# Altium schematic sheet SHT_1_Top Level_07349-R5_L10.SchDoc
size B; CompanyName: Microchip Technology Inc.; Organization: Microchip Technology; Address1: 2355 West Chandler Blvd.; Address2: Chandler, AZ  85224; Address4: USA; SheetNumber: 1; SheetTotal: 9; SheetTitle: Top Level Block Diagram; Time: Time
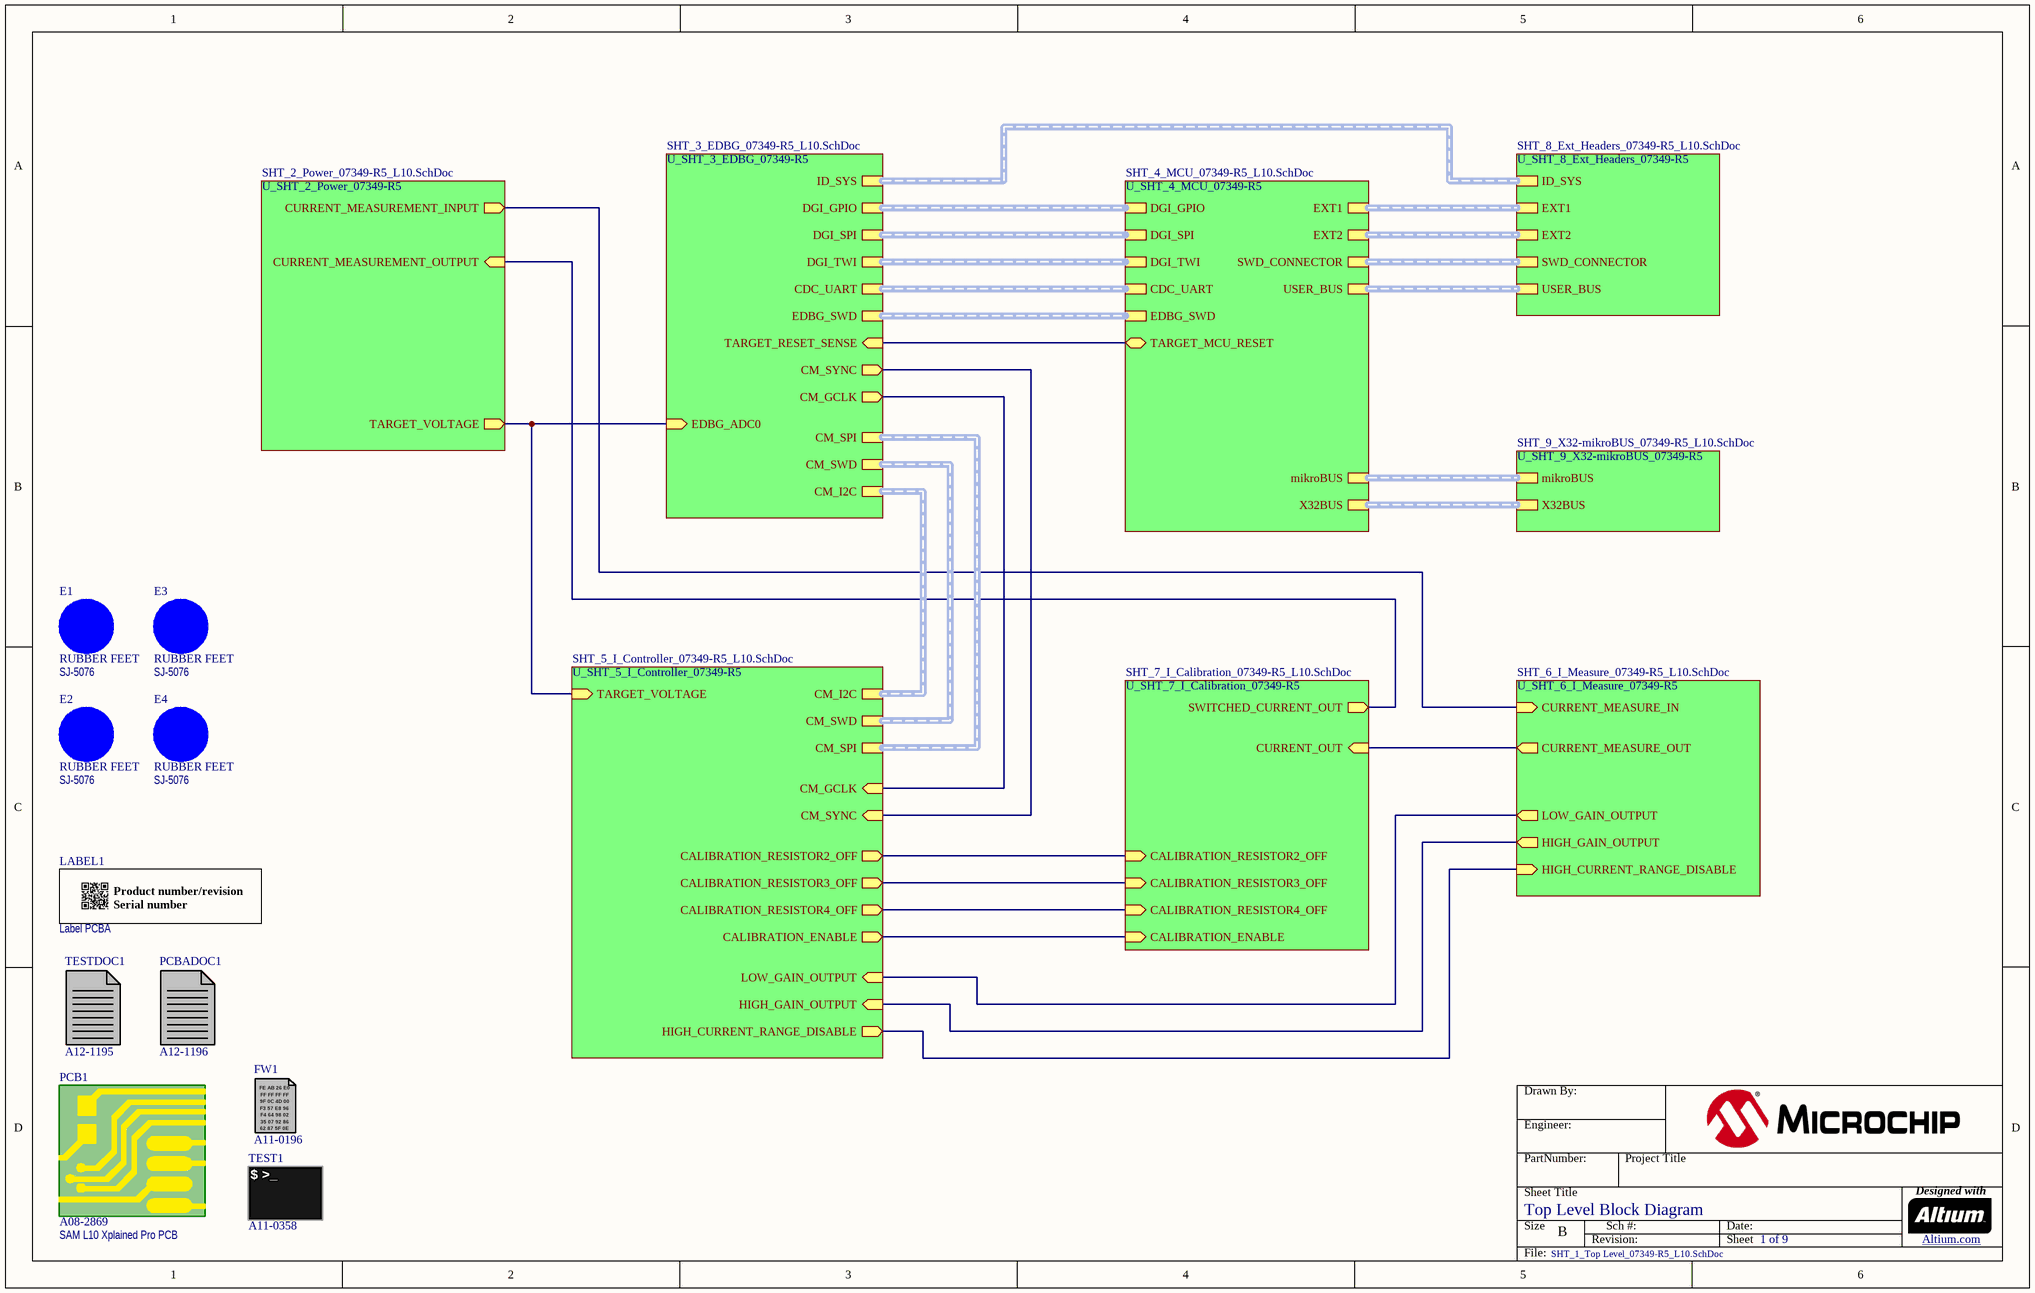
[diagram p0: SHT_1_Top Level_07349-R5_L10.SchDoc]

## Parts
?  (no value)  (graphical)
E1  RUBBER FEET  value SJ-5076  [AP8-00192]
E2  RUBBER FEET  value SJ-5076  [AP8-00192]
E3  RUBBER FEET  value SJ-5076  [AP8-00192]
E4  RUBBER FEET  value SJ-5076  [AP8-00192]
FW1  AN: A11-0196  (hidden comment: FW)  (mechanical)
LABEL1  value Label PCBA  [AP8-00317]  (hidden comment: PCBA_LABEL)
PCB1  value SAM L10 Xplained Pro PCB  AN: A08-2869  (hidden comment: PCB)  (mechanical)
PCBADOC1  AN: A12-1196  (hidden comment: PCBADOC)  (mechanical)
TEST1  AN: A11-0358  (hidden comment: TEST)  (mechanical)
TESTDOC1  AN: A12-1195  (hidden comment: TESTDOC)  (mechanical)

## Sub-sheets
U_SHT_2_Power_07349-R5 = SHT_2_Power_07349-R5_L10.SchDoc: TARGET_VOLTAGE (out), CURRENT_MEASUREMENT_INPUT (out), CURRENT_MEASUREMENT_OUTPUT (in)
U_SHT_3_EDBG_07349-R5 = SHT_3_EDBG_07349-R5_L10.SchDoc: CDC_UART (harness CDC_UART), DGI_TWI (harness DGI_TWI), DGI_SPI (harness DGI_SPI), DGI_GPIO (harness DGI_GPIO), ID_SYS (harness ID_SYS), EDBG_ADC0 (in), CM_I2C (harness CM_I2C), CM_GCLK (out), CM_SYNC (out), CM_SWD (harness CM_SWD), CM_SPI (harness CM_SPI), EDBG_SWD (harness EDBG_SWD), TARGET_RESET_SENSE (in)
U_SHT_4_MCU_07349-R5 = SHT_4_MCU_07349-R5_L10.SchDoc: DGI_GPIO (harness DGI_GPIO), DGI_SPI (harness DGI_SPI), DGI_TWI (harness DGI_TWI), CDC_UART (harness CDC_UART), EXT2 (harness EXT), EXT1 (harness EXT), SWD_CONNECTOR (harness SWD), TARGET_MCU_RESET (bidir), EDBG_SWD (harness EDBG_SWD), mikroBUS (harness mikroBUS), X32BUS (harness X32BUS), USER_BUS (harness USER_BUS)
U_SHT_5_I_Controller_07349-R5 = SHT_5_I_Controller_07349-R5_L10.SchDoc: LOW_GAIN_OUTPUT (in), HIGH_GAIN_OUTPUT (in), HIGH_CURRENT_RANGE_DISABLE (out), CM_SPI (harness CM_SPI), CALIBRATION_RESISTOR4_OFF (out), CALIBRATION_RESISTOR2_OFF (out), CALIBRATION_RESISTOR3_OFF (out), CALIBRATION_ENABLE (out), CM_I2C (harness CM_I2C), CM_GCLK (in), CM_SYNC (in), TARGET_VOLTAGE (in), CM_SWD (harness CM_SWD)
U_SHT_6_I_Measure_07349-R5 = SHT_6_I_Measure_07349-R5_L10.SchDoc: LOW_GAIN_OUTPUT (out), HIGH_GAIN_OUTPUT (out), HIGH_CURRENT_RANGE_DISABLE (in), CURRENT_MEASURE_OUT (out), CURRENT_MEASURE_IN (in)
U_SHT_7_I_Calibration_07349-R5 = SHT_7_I_Calibration_07349-R5_L10.SchDoc: CALIBRATION_RESISTOR3_OFF (in), CALIBRATION_RESISTOR4_OFF (in), CALIBRATION_RESISTOR2_OFF (in), SWITCHED_CURRENT_OUT (out), CURRENT_OUT (in), CALIBRATION_ENABLE (in)
U_SHT_8_Ext_Headers_07349-R5 = SHT_8_Ext_Headers_07349-R5_L10.SchDoc: ID_SYS (harness ID_SYS), EXT1 (harness EXT), EXT2 (harness EXT), SWD_CONNECTOR (harness SWD), USER_BUS (harness USER_BUS)
U_SHT_9_X32-mikroBUS_07349-R5 = SHT_9_X32-mikroBUS_07349-R5_L10.SchDoc: mikroBUS (harness mikroBUS), X32BUS (harness X32BUS)

## Nets
(unnamed): sheet U_SHT_7_I_Calibration_07349-R5/CALIBRATION_RESISTOR3_OFF, sheet U_SHT_5_I_Controller_07349-R5/CALIBRATION_RESISTOR3_OFF
(unnamed): sheet U_SHT_7_I_Calibration_07349-R5/CALIBRATION_RESISTOR4_OFF, sheet U_SHT_5_I_Controller_07349-R5/CALIBRATION_RESISTOR4_OFF
(unnamed): sheet U_SHT_7_I_Calibration_07349-R5/CALIBRATION_RESISTOR2_OFF, sheet U_SHT_5_I_Controller_07349-R5/CALIBRATION_RESISTOR2_OFF
(unnamed): sheet U_SHT_7_I_Calibration_07349-R5/SWITCHED_CURRENT_OUT, sheet U_SHT_2_Power_07349-R5/CURRENT_MEASUREMENT_OUTPUT
(unnamed): sheet U_SHT_7_I_Calibration_07349-R5/CURRENT_OUT, sheet U_SHT_6_I_Measure_07349-R5/CURRENT_MEASURE_OUT
(unnamed): sheet U_SHT_7_I_Calibration_07349-R5/CALIBRATION_ENABLE, sheet U_SHT_5_I_Controller_07349-R5/CALIBRATION_ENABLE
(unnamed): sheet U_SHT_6_I_Measure_07349-R5/LOW_GAIN_OUTPUT, sheet U_SHT_5_I_Controller_07349-R5/LOW_GAIN_OUTPUT
(unnamed): sheet U_SHT_6_I_Measure_07349-R5/HIGH_GAIN_OUTPUT, sheet U_SHT_5_I_Controller_07349-R5/HIGH_GAIN_OUTPUT
(unnamed): sheet U_SHT_6_I_Measure_07349-R5/HIGH_CURRENT_RANGE_DISABLE, sheet U_SHT_5_I_Controller_07349-R5/HIGH_CURRENT_RANGE_DISABLE
(unnamed): sheet U_SHT_6_I_Measure_07349-R5/CURRENT_MEASURE_IN, sheet U_SHT_2_Power_07349-R5/CURRENT_MEASUREMENT_INPUT
(unnamed): sheet U_SHT_4_MCU_07349-R5/TARGET_MCU_RESET, sheet U_SHT_3_EDBG_07349-R5/TARGET_RESET_SENSE
(unnamed): sheet U_SHT_3_EDBG_07349-R5/EDBG_ADC0, sheet U_SHT_2_Power_07349-R5/TARGET_VOLTAGE, sheet U_SHT_5_I_Controller_07349-R5/TARGET_VOLTAGE
(unnamed): sheet U_SHT_3_EDBG_07349-R5/CM_GCLK, sheet U_SHT_5_I_Controller_07349-R5/CM_GCLK
(unnamed): sheet U_SHT_3_EDBG_07349-R5/CM_SYNC, sheet U_SHT_5_I_Controller_07349-R5/CM_SYNC

Not connected (* = marked no-connect by the designer): E1 1(FIDUCIAL); E2 1(FIDUCIAL); E3 1(FIDUCIAL); E4 1(FIDUCIAL)

## Buses and harness runs
harness sheet U_SHT_3_EDBG_07349-R5/CDC_UART = sheet U_SHT_4_MCU_07349-R5/CDC_UART
harness sheet U_SHT_3_EDBG_07349-R5/CM_I2C = sheet U_SHT_5_I_Controller_07349-R5/CM_I2C
harness sheet U_SHT_3_EDBG_07349-R5/CM_SPI = sheet U_SHT_5_I_Controller_07349-R5/CM_SPI
harness sheet U_SHT_3_EDBG_07349-R5/CM_SWD = sheet U_SHT_5_I_Controller_07349-R5/CM_SWD
harness sheet U_SHT_3_EDBG_07349-R5/DGI_GPIO = sheet U_SHT_4_MCU_07349-R5/DGI_GPIO
harness sheet U_SHT_3_EDBG_07349-R5/DGI_SPI = sheet U_SHT_4_MCU_07349-R5/DGI_SPI
harness sheet U_SHT_3_EDBG_07349-R5/DGI_TWI = sheet U_SHT_4_MCU_07349-R5/DGI_TWI
harness sheet U_SHT_3_EDBG_07349-R5/EDBG_SWD = sheet U_SHT_4_MCU_07349-R5/EDBG_SWD
harness sheet U_SHT_3_EDBG_07349-R5/ID_SYS = sheet U_SHT_8_Ext_Headers_07349-R5/ID_SYS
harness sheet U_SHT_4_MCU_07349-R5/EXT1 = sheet U_SHT_8_Ext_Headers_07349-R5/EXT1
harness sheet U_SHT_4_MCU_07349-R5/EXT2 = sheet U_SHT_8_Ext_Headers_07349-R5/EXT2
harness sheet U_SHT_4_MCU_07349-R5/mikroBUS = sheet U_SHT_9_X32-mikroBUS_07349-R5/mikroBUS
harness sheet U_SHT_4_MCU_07349-R5/SWD_CONNECTOR = sheet U_SHT_8_Ext_Headers_07349-R5/SWD_CONNECTOR
harness sheet U_SHT_4_MCU_07349-R5/USER_BUS = sheet U_SHT_8_Ext_Headers_07349-R5/USER_BUS
harness sheet U_SHT_4_MCU_07349-R5/X32BUS = sheet U_SHT_9_X32-mikroBUS_07349-R5/X32BUS

## Notes on the sheet
- Drawn By:
- Engineer:
- PartNumber:
- Project Title
- Sheet Title
- Size
- B
- Revision:
- Sch #:
- Date:
- Sheet
- Designed with
- Altium.com <http://go.altium.com/MicrochipLandingPage_Evaluation.html>
- File:
- (in symbol A09-0611) / Product number/revision / Serial number
- (in symbol A11-0196) FE AB 26 E0; FF FF FF FF; 9F 0C 4D 00; F3 57 E8 96; F4 64 98 02; 35 07 92 86; 62 87 5F 0E
- (in symbol A11-0358) $ >_

## Library data of the parts
? = Title Block B
E1-E4 = A08-0053: 2.8mm adhesive feet,diam 8.0mm; PartGroup: Mechanical devices,Mounting accessories; Manufacturer: 3M; ComponentStatus: 'Active (verified)'; Verified date: 2006-05-05; Verified by: Ketil Skjerve; Status: Active; AN: A08-0053; Height: 2.79999995231628; MPN: SJ-5076; FootprintStatus: 'Active (Verified)'
FW1 = A11-0196: EDBG secured firmware; PartGroup: Software,Firmware,Tools; Manufacturer: ATMEL; ComponentStatus: 'Active (verified)'; Value: EDBG secured firmware
LABEL1 = A09-0611: PCBA identification label PP Top White Gloss; PartGroup: Mechanical devices,Packaging materials,Printed Labels; Manufacturer: ACT Logimark AS; MPN: 505462; ComponentStatus: 'Active (verified)'; Status: New; AN: A09-0611; FootprintStatus: 'Active (Verified)'
PCB1 = A08-2869: SAM L10 Xplained Pro PCB, 4 layer, 60mm x 100mm; PartGroup: Mechanical devices,Printed circuit boards; ComponentStatus: 'Active (verified)'
PCBADOC1 = A12-1196: SAM L10 Xplained Pro PCBA documentation; PartGroup: Documentation,PCBA Documents,Atmel; Value: A09-2769 PCBA Files; ComponentStatus: 'Active (verified)'
TEST1 = A11-0358: Fixture test for SAM L10 Xplained Pro; PartGroup: Software,Test software,Starter Kit; Value: SAM L10 Xplained Pro test; ComponentStatus: 'Active (verified)'
TESTDOC1 = A12-1195: SAM L10 Xplained Pro Test Instructions; PartGroup: Documentation,Procedures,Test Instructions; ComponentStatus: 'Active (verified)'; Value: SAM L10 Xplained Pro Test Instructions